# Vivado block design ps, Vivado 2016.2
# (continued, part 2 of 3)
current_bd_instance /RX

# ---- hierarchy /RX/rx_1 ----
current_bd_instance /RX/rx_1
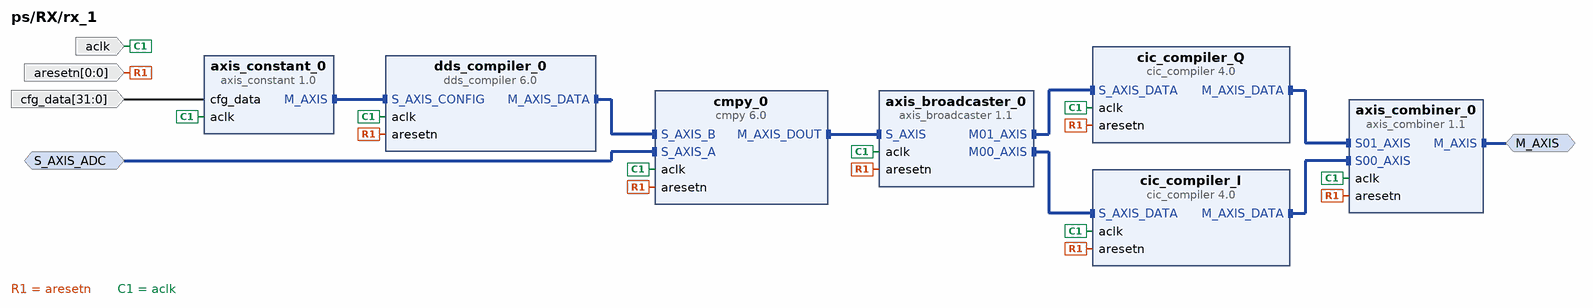
[diagram p5: block diagram inside /RX/rx_1]
create_bd_intf_pin -mode Slave -vlnv xilinx.com:interface:axis_rtl:1.0 S_AXIS_ADC
create_bd_intf_pin -mode Master -vlnv xilinx.com:interface:axis_rtl:1.0 M_AXIS
create_bd_pin -dir I aclk
create_bd_pin -dir I -from 0 -to 0 aresetn
create_bd_pin -dir I -from 31 -to 0 cfg_data

create_bd_cell -type ip -vlnv pavel-demin:user:axis_constant:1.0 axis_constant_0
create_bd_cell -type ip -vlnv xilinx.com:ip:axis_broadcaster:1.1 axis_broadcaster_0
set_property -dict [list \
  CONFIG.M_TDATA_NUM_BYTES 4 \
  CONFIG.S_TDATA_NUM_BYTES 8 \
  CONFIG.M00_TDATA_REMAP {tdata[31:0]} \
  CONFIG.M01_TDATA_REMAP {tdata[63:32]} \
] [get_bd_cells axis_broadcaster_0]
create_bd_cell -type ip -vlnv xilinx.com:ip:axis_combiner:1.1 axis_combiner_0
set_property -dict {CONFIG.TDATA_NUM_BYTES 4 CONFIG.HAS_TLAST 1} [get_bd_cells axis_combiner_0]
create_bd_cell -type ip -vlnv xilinx.com:ip:cic_compiler:4.0 cic_compiler_I
set_property -dict [list \
  CONFIG.Filter_Type Decimation \
  CONFIG.Number_Of_Stages 5 \
  CONFIG.Fixed_Or_Initial_Rate 32 \
  CONFIG.Minimum_Rate 32 \
  CONFIG.Maximum_Rate 32 \
  CONFIG.Input_Sample_Frequency 125 \
  CONFIG.Clock_Frequency 125 \
  CONFIG.SamplePeriod 1 \
  CONFIG.Input_Data_Width 32 \
  CONFIG.Quantization Truncation \
  CONFIG.Output_Data_Width 32 \
  CONFIG.Use_Xtreme_DSP_Slice false \
  CONFIG.HAS_ARESETN true \
  CONFIG.HAS_DOUT_TREADY true \
] [get_bd_cells cic_compiler_I]
create_bd_cell -type ip -vlnv xilinx.com:ip:cic_compiler:4.0 cic_compiler_Q
set_property -dict [list \
  CONFIG.Filter_Type Decimation \
  CONFIG.Number_Of_Stages 5 \
  CONFIG.Fixed_Or_Initial_Rate 32 \
  CONFIG.Minimum_Rate 32 \
  CONFIG.Maximum_Rate 32 \
  CONFIG.Input_Sample_Frequency 125 \
  CONFIG.Clock_Frequency 125 \
  CONFIG.SamplePeriod 1 \
  CONFIG.Input_Data_Width 32 \
  CONFIG.Quantization Truncation \
  CONFIG.Output_Data_Width 32 \
  CONFIG.Use_Xtreme_DSP_Slice false \
  CONFIG.HAS_ARESETN true \
  CONFIG.HAS_DOUT_TREADY true \
] [get_bd_cells cic_compiler_Q]
create_bd_cell -type ip -vlnv xilinx.com:ip:cmpy:6.0 cmpy_0
set_property -dict [list \
  CONFIG.APortWidth 16 \
  CONFIG.BPortWidth 24 \
  CONFIG.FlowControl Blocking \
  CONFIG.RoundMode Truncate \
  CONFIG.OutputWidth 32 \
  CONFIG.MinimumLatency 9 \
  CONFIG.ARESETN true \
] [get_bd_cells cmpy_0]
create_bd_cell -type ip -vlnv xilinx.com:ip:dds_compiler:6.0 dds_compiler_0
set_property -dict [list \
  CONFIG.PartsPresent Phase_Generator_and_SIN_COS_LUT \
  CONFIG.DDS_Clock_Rate 125 \
  CONFIG.Parameter_Entry System_Parameters \
  CONFIG.Spurious_Free_Dynamic_Range 138 \
  CONFIG.Frequency_Resolution 0.2 \
  CONFIG.Noise_Shaping Auto \
  CONFIG.Phase_Width 30 \
  CONFIG.Output_Width 24 \
  CONFIG.Phase_Increment Programmable \
  CONFIG.Negative_Sine true \
  CONFIG.Optimization_Goal Auto \
  CONFIG.DSP48_Use Minimal \
  CONFIG.Has_Phase_Out false \
  CONFIG.DATA_Has_TLAST Not_Required \
  CONFIG.Has_TREADY true \
  CONFIG.S_PHASE_Has_TUSER Not_Required \
  CONFIG.M_DATA_Has_TUSER Not_Required \
  CONFIG.Latency 16 \
  CONFIG.Has_ARESETn true \
  CONFIG.Output_Frequency1 0 \
  CONFIG.PINC1 0 \
] [get_bd_cells dds_compiler_0]

# ---- hierarchy /RX/RX_Connect ----
current_bd_instance /RX/RX_Connect
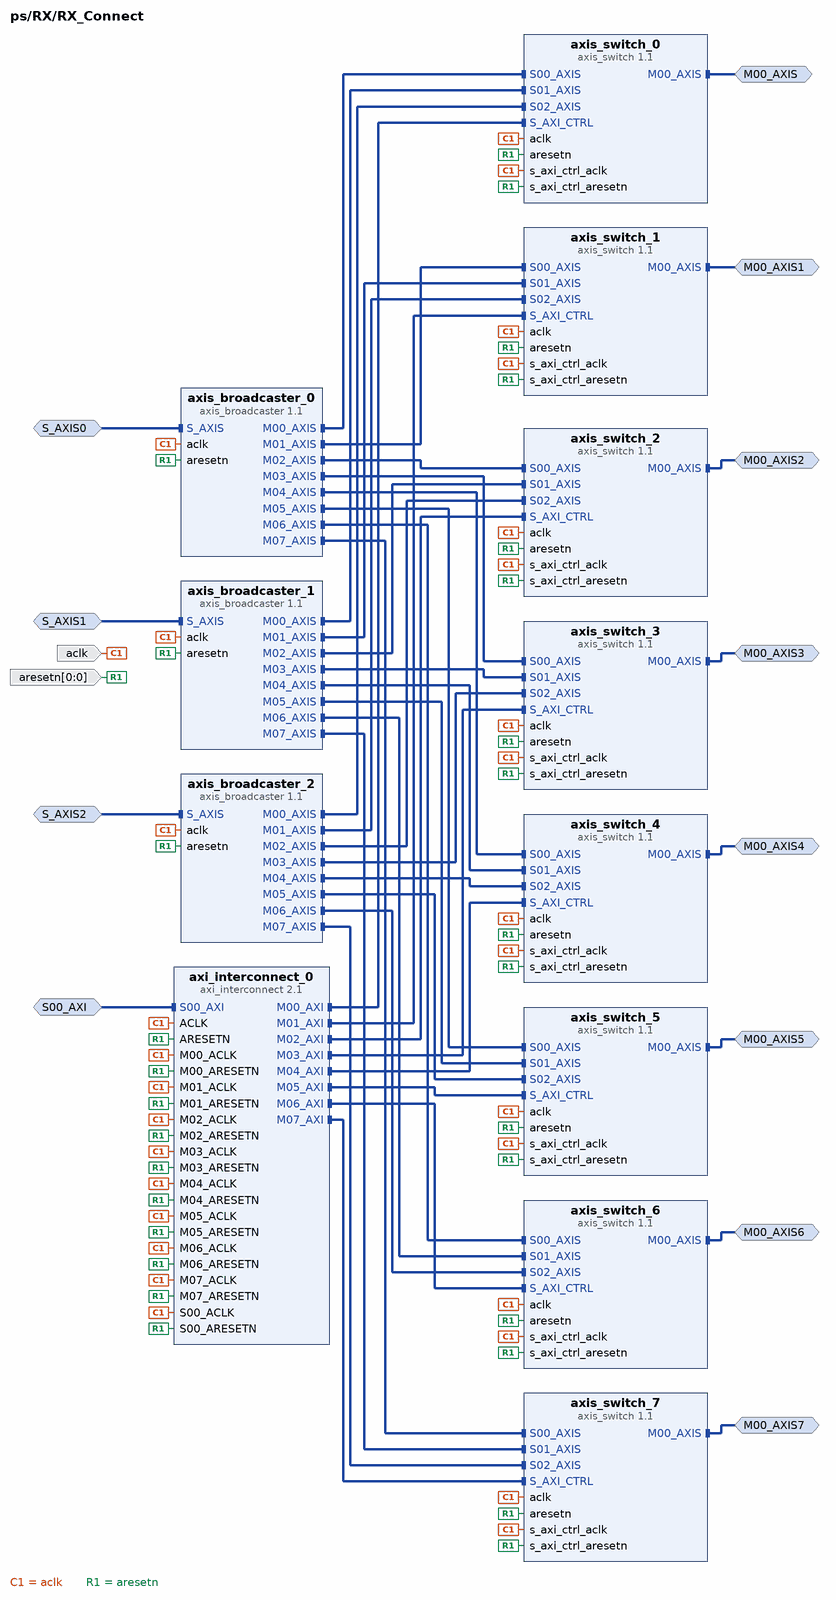
[diagram p6: block diagram inside /RX/RX_Connect]
create_bd_intf_pin -mode Master -vlnv xilinx.com:interface:axis_rtl:1.0 M00_AXIS
create_bd_intf_pin -mode Master -vlnv xilinx.com:interface:axis_rtl:1.0 M00_AXIS1
create_bd_intf_pin -mode Master -vlnv xilinx.com:interface:axis_rtl:1.0 M00_AXIS2
create_bd_intf_pin -mode Slave -vlnv xilinx.com:interface:axis_rtl:1.0 S_AXIS2
create_bd_intf_pin -mode Master -vlnv xilinx.com:interface:axis_rtl:1.0 M00_AXIS3
create_bd_intf_pin -mode Slave -vlnv xilinx.com:interface:axis_rtl:1.0 S_AXIS1
create_bd_intf_pin -mode Slave -vlnv xilinx.com:interface:axis_rtl:1.0 S_AXIS0
create_bd_intf_pin -mode Slave -vlnv xilinx.com:interface:aximm_rtl:1.0 S00_AXI
create_bd_intf_pin -mode Master -vlnv xilinx.com:interface:axis_rtl:1.0 M00_AXIS4
create_bd_intf_pin -mode Master -vlnv xilinx.com:interface:axis_rtl:1.0 M00_AXIS5
create_bd_intf_pin -mode Master -vlnv xilinx.com:interface:axis_rtl:1.0 M00_AXIS6
create_bd_intf_pin -mode Master -vlnv xilinx.com:interface:axis_rtl:1.0 M00_AXIS7
create_bd_pin -dir I -type clk aclk
create_bd_pin -dir I -from 0 -to 0 -type rst aresetn

create_bd_cell -type ip -vlnv xilinx.com:ip:axi_interconnect:2.1 axi_interconnect_0
set_property -dict [list \
  CONFIG.NUM_MI 8 \
  CONFIG.STRATEGY 1 \
  CONFIG.ENABLE_ADVANCED_OPTIONS 0 \
  CONFIG.M00_HAS_REGSLICE 0 \
] [get_bd_cells axi_interconnect_0]
create_bd_cell -type ip -vlnv xilinx.com:ip:axis_broadcaster:1.1 axis_broadcaster_0
set_property -dict [list \
  CONFIG.NUM_MI 8 \
  CONFIG.M_TDATA_NUM_BYTES 4 \
  CONFIG.S_TDATA_NUM_BYTES 4 \
  CONFIG.HAS_TREADY 0 \
  CONFIG.M02_TDATA_REMAP {tdata[31:0]} \
  CONFIG.M03_TDATA_REMAP {tdata[31:0]} \
  CONFIG.M04_TDATA_REMAP {tdata[31:0]} \
  CONFIG.M05_TDATA_REMAP {tdata[31:0]} \
  CONFIG.M06_TDATA_REMAP {tdata[31:0]} \
  CONFIG.M07_TDATA_REMAP {tdata[31:0]} \
  CONFIG.M08_TDATA_REMAP {tdata[31:0]} \
  CONFIG.M09_TDATA_REMAP {tdata[31:0]} \
  CONFIG.M10_TDATA_REMAP {tdata[31:0]} \
  CONFIG.M11_TDATA_REMAP {tdata[31:0]} \
  CONFIG.M12_TDATA_REMAP {tdata[31:0]} \
  CONFIG.M13_TDATA_REMAP {tdata[31:0]} \
  CONFIG.M14_TDATA_REMAP {tdata[31:0]} \
  CONFIG.M15_TDATA_REMAP {tdata[31:0]} \
] [get_bd_cells axis_broadcaster_0]
create_bd_cell -type ip -vlnv xilinx.com:ip:axis_broadcaster:1.1 axis_broadcaster_2
set_property -dict [list \
  CONFIG.NUM_MI 8 \
  CONFIG.M_TDATA_NUM_BYTES 4 \
  CONFIG.S_TDATA_NUM_BYTES 4 \
  CONFIG.HAS_TREADY 0 \
  CONFIG.M02_TDATA_REMAP {tdata[31:0]} \
  CONFIG.M03_TDATA_REMAP {tdata[31:0]} \
  CONFIG.M04_TDATA_REMAP {tdata[31:0]} \
  CONFIG.M05_TDATA_REMAP {tdata[31:0]} \
  CONFIG.M06_TDATA_REMAP {tdata[31:0]} \
  CONFIG.M07_TDATA_REMAP {tdata[31:0]} \
  CONFIG.M08_TDATA_REMAP {tdata[31:0]} \
  CONFIG.M09_TDATA_REMAP {tdata[31:0]} \
  CONFIG.M10_TDATA_REMAP {tdata[31:0]} \
  CONFIG.M11_TDATA_REMAP {tdata[31:0]} \
  CONFIG.M12_TDATA_REMAP {tdata[31:0]} \
  CONFIG.M13_TDATA_REMAP {tdata[31:0]} \
  CONFIG.M14_TDATA_REMAP {tdata[31:0]} \
  CONFIG.M15_TDATA_REMAP {tdata[31:0]} \
] [get_bd_cells axis_broadcaster_2]
create_bd_cell -type ip -vlnv xilinx.com:ip:axis_broadcaster:1.1 axis_broadcaster_1
set_property -dict [list \
  CONFIG.NUM_MI 8 \
  CONFIG.M_TDATA_NUM_BYTES 4 \
  CONFIG.S_TDATA_NUM_BYTES 4 \
  CONFIG.HAS_TREADY 0 \
  CONFIG.M02_TDATA_REMAP {tdata[31:0]} \
  CONFIG.M03_TDATA_REMAP {tdata[31:0]} \
  CONFIG.M04_TDATA_REMAP {tdata[31:0]} \
  CONFIG.M05_TDATA_REMAP {tdata[31:0]} \
  CONFIG.M06_TDATA_REMAP {tdata[31:0]} \
  CONFIG.M07_TDATA_REMAP {tdata[31:0]} \
  CONFIG.M08_TDATA_REMAP {tdata[31:0]} \
  CONFIG.M09_TDATA_REMAP {tdata[31:0]} \
  CONFIG.M10_TDATA_REMAP {tdata[31:0]} \
  CONFIG.M11_TDATA_REMAP {tdata[31:0]} \
  CONFIG.M12_TDATA_REMAP {tdata[31:0]} \
  CONFIG.M13_TDATA_REMAP {tdata[31:0]} \
  CONFIG.M14_TDATA_REMAP {tdata[31:0]} \
  CONFIG.M15_TDATA_REMAP {tdata[31:0]} \
] [get_bd_cells axis_broadcaster_1]
create_bd_cell -type ip -vlnv xilinx.com:ip:axis_switch:1.1 axis_switch_0
set_property -dict [list \
  CONFIG.NUM_SI 3 \
  CONFIG.ROUTING_MODE 1 \
  CONFIG.HAS_TREADY 0 \
  CONFIG.TDATA_NUM_BYTES 4 \
] [get_bd_cells axis_switch_0]
create_bd_cell -type ip -vlnv xilinx.com:ip:axis_switch:1.1 axis_switch_1
set_property -dict [list \
  CONFIG.NUM_SI 3 \
  CONFIG.ROUTING_MODE 1 \
  CONFIG.HAS_TREADY 0 \
  CONFIG.TDATA_NUM_BYTES 4 \
] [get_bd_cells axis_switch_1]
create_bd_cell -type ip -vlnv xilinx.com:ip:axis_switch:1.1 axis_switch_2
set_property -dict [list \
  CONFIG.NUM_SI 3 \
  CONFIG.ROUTING_MODE 1 \
  CONFIG.HAS_TREADY 0 \
  CONFIG.TDATA_NUM_BYTES 4 \
] [get_bd_cells axis_switch_2]
create_bd_cell -type ip -vlnv xilinx.com:ip:axis_switch:1.1 axis_switch_3
set_property -dict [list \
  CONFIG.NUM_SI 3 \
  CONFIG.ROUTING_MODE 1 \
  CONFIG.HAS_TREADY 0 \
  CONFIG.TDATA_NUM_BYTES 4 \
] [get_bd_cells axis_switch_3]
create_bd_cell -type ip -vlnv xilinx.com:ip:axis_switch:1.1 axis_switch_4
set_property -dict [list \
  CONFIG.NUM_SI 3 \
  CONFIG.ROUTING_MODE 1 \
  CONFIG.HAS_TREADY 0 \
  CONFIG.TDATA_NUM_BYTES 4 \
] [get_bd_cells axis_switch_4]
create_bd_cell -type ip -vlnv xilinx.com:ip:axis_switch:1.1 axis_switch_5
set_property -dict [list \
  CONFIG.NUM_SI 3 \
  CONFIG.ROUTING_MODE 1 \
  CONFIG.HAS_TREADY 0 \
  CONFIG.TDATA_NUM_BYTES 4 \
] [get_bd_cells axis_switch_5]
create_bd_cell -type ip -vlnv xilinx.com:ip:axis_switch:1.1 axis_switch_6
set_property -dict [list \
  CONFIG.NUM_SI 3 \
  CONFIG.ROUTING_MODE 1 \
  CONFIG.HAS_TREADY 0 \
  CONFIG.TDATA_NUM_BYTES 4 \
] [get_bd_cells axis_switch_6]
create_bd_cell -type ip -vlnv xilinx.com:ip:axis_switch:1.1 axis_switch_7
set_property -dict [list \
  CONFIG.NUM_SI 3 \
  CONFIG.ROUTING_MODE 1 \
  CONFIG.HAS_TREADY 0 \
  CONFIG.TDATA_NUM_BYTES 4 \
] [get_bd_cells axis_switch_7]

# ---- hierarchy /RX/rx_2 ----
current_bd_instance /RX/rx_2
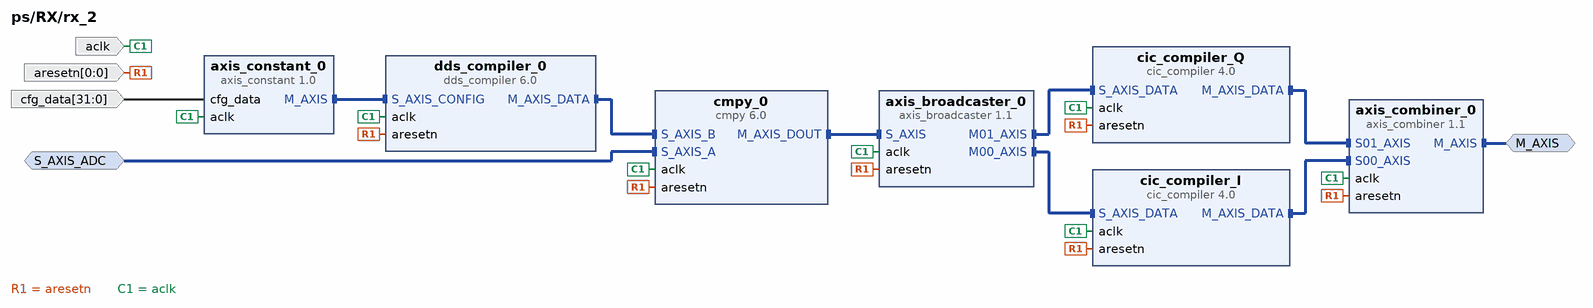
[diagram p7: block diagram inside /RX/rx_2]
create_bd_intf_pin -mode Slave -vlnv xilinx.com:interface:axis_rtl:1.0 S_AXIS_ADC
create_bd_intf_pin -mode Master -vlnv xilinx.com:interface:axis_rtl:1.0 M_AXIS
create_bd_pin -dir I aclk
create_bd_pin -dir I -from 0 -to 0 aresetn
create_bd_pin -dir I -from 31 -to 0 cfg_data

create_bd_cell -type ip -vlnv pavel-demin:user:axis_constant:1.0 axis_constant_0
create_bd_cell -type ip -vlnv xilinx.com:ip:axis_broadcaster:1.1 axis_broadcaster_0
set_property -dict [list \
  CONFIG.M_TDATA_NUM_BYTES 4 \
  CONFIG.S_TDATA_NUM_BYTES 8 \
  CONFIG.M00_TDATA_REMAP {tdata[31:0]} \
  CONFIG.M01_TDATA_REMAP {tdata[63:32]} \
] [get_bd_cells axis_broadcaster_0]
create_bd_cell -type ip -vlnv xilinx.com:ip:axis_combiner:1.1 axis_combiner_0
set_property -dict {CONFIG.TDATA_NUM_BYTES 4 CONFIG.HAS_TLAST 1} [get_bd_cells axis_combiner_0]
create_bd_cell -type ip -vlnv xilinx.com:ip:cic_compiler:4.0 cic_compiler_I
set_property -dict [list \
  CONFIG.Filter_Type Decimation \
  CONFIG.Number_Of_Stages 5 \
  CONFIG.Fixed_Or_Initial_Rate 32 \
  CONFIG.Minimum_Rate 32 \
  CONFIG.Maximum_Rate 32 \
  CONFIG.Input_Sample_Frequency 125 \
  CONFIG.Clock_Frequency 125 \
  CONFIG.SamplePeriod 1 \
  CONFIG.Input_Data_Width 32 \
  CONFIG.Quantization Truncation \
  CONFIG.Output_Data_Width 32 \
  CONFIG.Use_Xtreme_DSP_Slice false \
  CONFIG.HAS_ARESETN true \
  CONFIG.HAS_DOUT_TREADY true \
] [get_bd_cells cic_compiler_I]
create_bd_cell -type ip -vlnv xilinx.com:ip:cic_compiler:4.0 cic_compiler_Q
set_property -dict [list \
  CONFIG.Filter_Type Decimation \
  CONFIG.Number_Of_Stages 5 \
  CONFIG.Fixed_Or_Initial_Rate 32 \
  CONFIG.Minimum_Rate 32 \
  CONFIG.Maximum_Rate 32 \
  CONFIG.Input_Sample_Frequency 125 \
  CONFIG.Clock_Frequency 125 \
  CONFIG.SamplePeriod 1 \
  CONFIG.Input_Data_Width 32 \
  CONFIG.Quantization Truncation \
  CONFIG.Output_Data_Width 32 \
  CONFIG.Use_Xtreme_DSP_Slice false \
  CONFIG.HAS_ARESETN true \
  CONFIG.HAS_DOUT_TREADY true \
] [get_bd_cells cic_compiler_Q]
create_bd_cell -type ip -vlnv xilinx.com:ip:cmpy:6.0 cmpy_0
set_property -dict [list \
  CONFIG.APortWidth 16 \
  CONFIG.BPortWidth 24 \
  CONFIG.FlowControl Blocking \
  CONFIG.RoundMode Truncate \
  CONFIG.OutputWidth 32 \
  CONFIG.MinimumLatency 9 \
  CONFIG.ARESETN true \
] [get_bd_cells cmpy_0]
create_bd_cell -type ip -vlnv xilinx.com:ip:dds_compiler:6.0 dds_compiler_0
set_property -dict [list \
  CONFIG.PartsPresent Phase_Generator_and_SIN_COS_LUT \
  CONFIG.DDS_Clock_Rate 125 \
  CONFIG.Parameter_Entry System_Parameters \
  CONFIG.Spurious_Free_Dynamic_Range 138 \
  CONFIG.Frequency_Resolution 0.2 \
  CONFIG.Noise_Shaping Auto \
  CONFIG.Phase_Width 30 \
  CONFIG.Output_Width 24 \
  CONFIG.Phase_Increment Programmable \
  CONFIG.Negative_Sine true \
  CONFIG.Optimization_Goal Auto \
  CONFIG.DSP48_Use Minimal \
  CONFIG.Has_Phase_Out false \
  CONFIG.DATA_Has_TLAST Not_Required \
  CONFIG.Has_TREADY true \
  CONFIG.S_PHASE_Has_TUSER Not_Required \
  CONFIG.M_DATA_Has_TUSER Not_Required \
  CONFIG.Latency 16 \
  CONFIG.Has_ARESETn true \
  CONFIG.Output_Frequency1 0 \
  CONFIG.PINC1 0 \
] [get_bd_cells dds_compiler_0]

# ---- hierarchy /RX/rx_3 ----
current_bd_instance /RX/rx_3
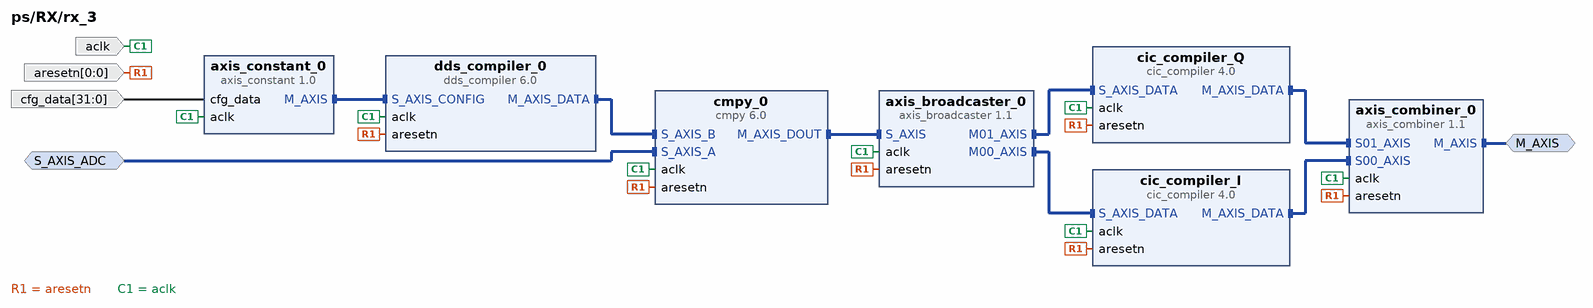
[diagram p8: block diagram inside /RX/rx_3]
create_bd_intf_pin -mode Slave -vlnv xilinx.com:interface:axis_rtl:1.0 S_AXIS_ADC
create_bd_intf_pin -mode Master -vlnv xilinx.com:interface:axis_rtl:1.0 M_AXIS
create_bd_pin -dir I aclk
create_bd_pin -dir I -from 0 -to 0 aresetn
create_bd_pin -dir I -from 31 -to 0 cfg_data

create_bd_cell -type ip -vlnv pavel-demin:user:axis_constant:1.0 axis_constant_0
create_bd_cell -type ip -vlnv xilinx.com:ip:axis_broadcaster:1.1 axis_broadcaster_0
set_property -dict [list \
  CONFIG.M_TDATA_NUM_BYTES 4 \
  CONFIG.S_TDATA_NUM_BYTES 8 \
  CONFIG.M00_TDATA_REMAP {tdata[31:0]} \
  CONFIG.M01_TDATA_REMAP {tdata[63:32]} \
] [get_bd_cells axis_broadcaster_0]
create_bd_cell -type ip -vlnv xilinx.com:ip:axis_combiner:1.1 axis_combiner_0
set_property -dict {CONFIG.TDATA_NUM_BYTES 4 CONFIG.HAS_TLAST 1} [get_bd_cells axis_combiner_0]
create_bd_cell -type ip -vlnv xilinx.com:ip:cic_compiler:4.0 cic_compiler_I
set_property -dict [list \
  CONFIG.Filter_Type Decimation \
  CONFIG.Number_Of_Stages 5 \
  CONFIG.Fixed_Or_Initial_Rate 32 \
  CONFIG.Minimum_Rate 32 \
  CONFIG.Maximum_Rate 32 \
  CONFIG.Input_Sample_Frequency 125 \
  CONFIG.Clock_Frequency 125 \
  CONFIG.SamplePeriod 1 \
  CONFIG.Input_Data_Width 32 \
  CONFIG.Quantization Truncation \
  CONFIG.Output_Data_Width 32 \
  CONFIG.Use_Xtreme_DSP_Slice false \
  CONFIG.HAS_ARESETN true \
  CONFIG.HAS_DOUT_TREADY true \
] [get_bd_cells cic_compiler_I]
create_bd_cell -type ip -vlnv xilinx.com:ip:cic_compiler:4.0 cic_compiler_Q
set_property -dict [list \
  CONFIG.Filter_Type Decimation \
  CONFIG.Number_Of_Stages 5 \
  CONFIG.Fixed_Or_Initial_Rate 32 \
  CONFIG.Minimum_Rate 32 \
  CONFIG.Maximum_Rate 32 \
  CONFIG.Input_Sample_Frequency 125 \
  CONFIG.Clock_Frequency 125 \
  CONFIG.SamplePeriod 1 \
  CONFIG.Input_Data_Width 32 \
  CONFIG.Quantization Truncation \
  CONFIG.Output_Data_Width 32 \
  CONFIG.Use_Xtreme_DSP_Slice false \
  CONFIG.HAS_ARESETN true \
  CONFIG.HAS_DOUT_TREADY true \
] [get_bd_cells cic_compiler_Q]
create_bd_cell -type ip -vlnv xilinx.com:ip:cmpy:6.0 cmpy_0
set_property -dict [list \
  CONFIG.APortWidth 16 \
  CONFIG.BPortWidth 24 \
  CONFIG.FlowControl Blocking \
  CONFIG.RoundMode Truncate \
  CONFIG.OutputWidth 32 \
  CONFIG.MinimumLatency 9 \
  CONFIG.ARESETN true \
] [get_bd_cells cmpy_0]
create_bd_cell -type ip -vlnv xilinx.com:ip:dds_compiler:6.0 dds_compiler_0
set_property -dict [list \
  CONFIG.PartsPresent Phase_Generator_and_SIN_COS_LUT \
  CONFIG.DDS_Clock_Rate 125 \
  CONFIG.Parameter_Entry System_Parameters \
  CONFIG.Spurious_Free_Dynamic_Range 138 \
  CONFIG.Frequency_Resolution 0.2 \
  CONFIG.Noise_Shaping Auto \
  CONFIG.Phase_Width 30 \
  CONFIG.Output_Width 24 \
  CONFIG.Phase_Increment Programmable \
  CONFIG.Negative_Sine true \
  CONFIG.Optimization_Goal Auto \
  CONFIG.DSP48_Use Minimal \
  CONFIG.Has_Phase_Out false \
  CONFIG.DATA_Has_TLAST Not_Required \
  CONFIG.Has_TREADY true \
  CONFIG.S_PHASE_Has_TUSER Not_Required \
  CONFIG.M_DATA_Has_TUSER Not_Required \
  CONFIG.Latency 16 \
  CONFIG.Has_ARESETn true \
  CONFIG.Output_Frequency1 0 \
  CONFIG.PINC1 0 \
] [get_bd_cells dds_compiler_0]

# ---- hierarchy /RX/rx_0 ----
current_bd_instance /RX/rx_0
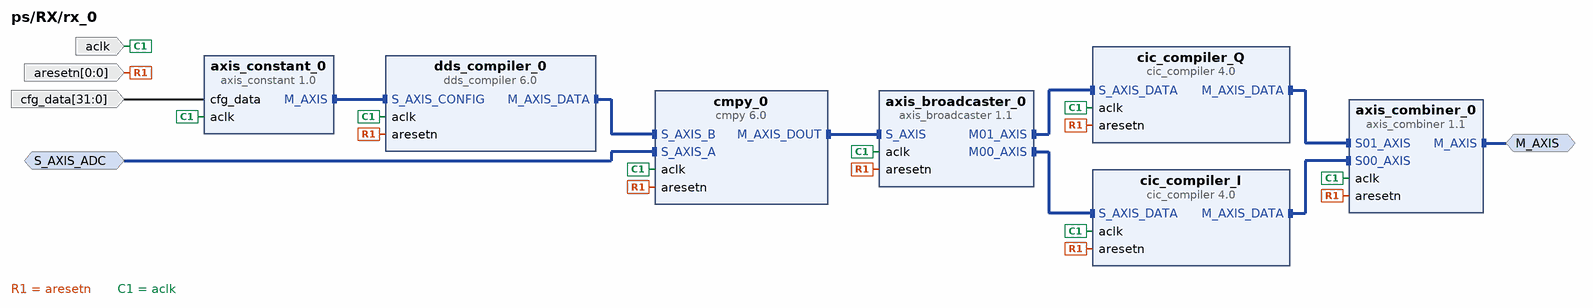
[diagram p9: block diagram inside /RX/rx_0]
create_bd_intf_pin -mode Slave -vlnv xilinx.com:interface:axis_rtl:1.0 S_AXIS_ADC
create_bd_intf_pin -mode Master -vlnv xilinx.com:interface:axis_rtl:1.0 M_AXIS
create_bd_pin -dir I aclk
create_bd_pin -dir I -from 0 -to 0 aresetn
create_bd_pin -dir I -from 31 -to 0 cfg_data

create_bd_cell -type ip -vlnv pavel-demin:user:axis_constant:1.0 axis_constant_0
create_bd_cell -type ip -vlnv xilinx.com:ip:axis_broadcaster:1.1 axis_broadcaster_0
set_property -dict [list \
  CONFIG.M_TDATA_NUM_BYTES 4 \
  CONFIG.S_TDATA_NUM_BYTES 8 \
  CONFIG.M00_TDATA_REMAP {tdata[31:0]} \
  CONFIG.M01_TDATA_REMAP {tdata[63:32]} \
] [get_bd_cells axis_broadcaster_0]
create_bd_cell -type ip -vlnv xilinx.com:ip:axis_combiner:1.1 axis_combiner_0
set_property -dict {CONFIG.TDATA_NUM_BYTES 4 CONFIG.HAS_TLAST 1} [get_bd_cells axis_combiner_0]
create_bd_cell -type ip -vlnv xilinx.com:ip:cic_compiler:4.0 cic_compiler_I
set_property -dict [list \
  CONFIG.Filter_Type Decimation \
  CONFIG.Number_Of_Stages 5 \
  CONFIG.Fixed_Or_Initial_Rate 32 \
  CONFIG.Minimum_Rate 32 \
  CONFIG.Maximum_Rate 32 \
  CONFIG.Input_Sample_Frequency 125 \
  CONFIG.Clock_Frequency 125 \
  CONFIG.SamplePeriod 1 \
  CONFIG.Input_Data_Width 32 \
  CONFIG.Quantization Truncation \
  CONFIG.Output_Data_Width 32 \
  CONFIG.Use_Xtreme_DSP_Slice false \
  CONFIG.HAS_ARESETN true \
  CONFIG.HAS_DOUT_TREADY true \
] [get_bd_cells cic_compiler_I]
create_bd_cell -type ip -vlnv xilinx.com:ip:cic_compiler:4.0 cic_compiler_Q
set_property -dict [list \
  CONFIG.Filter_Type Decimation \
  CONFIG.Number_Of_Stages 5 \
  CONFIG.Fixed_Or_Initial_Rate 32 \
  CONFIG.Minimum_Rate 32 \
  CONFIG.Maximum_Rate 32 \
  CONFIG.Input_Sample_Frequency 125 \
  CONFIG.Clock_Frequency 125 \
  CONFIG.SamplePeriod 1 \
  CONFIG.Input_Data_Width 32 \
  CONFIG.Quantization Truncation \
  CONFIG.Output_Data_Width 32 \
  CONFIG.Use_Xtreme_DSP_Slice false \
  CONFIG.HAS_ARESETN true \
  CONFIG.HAS_DOUT_TREADY true \
] [get_bd_cells cic_compiler_Q]
create_bd_cell -type ip -vlnv xilinx.com:ip:cmpy:6.0 cmpy_0
set_property -dict [list \
  CONFIG.APortWidth 16 \
  CONFIG.BPortWidth 24 \
  CONFIG.FlowControl Blocking \
  CONFIG.RoundMode Truncate \
  CONFIG.OutputWidth 32 \
  CONFIG.MinimumLatency 9 \
  CONFIG.ARESETN true \
] [get_bd_cells cmpy_0]
create_bd_cell -type ip -vlnv xilinx.com:ip:dds_compiler:6.0 dds_compiler_0
set_property -dict [list \
  CONFIG.PartsPresent Phase_Generator_and_SIN_COS_LUT \
  CONFIG.DDS_Clock_Rate 125 \
  CONFIG.Parameter_Entry System_Parameters \
  CONFIG.Spurious_Free_Dynamic_Range 138 \
  CONFIG.Frequency_Resolution 0.2 \
  CONFIG.Noise_Shaping Auto \
  CONFIG.Phase_Width 30 \
  CONFIG.Output_Width 24 \
  CONFIG.Phase_Increment Programmable \
  CONFIG.Negative_Sine true \
  CONFIG.Optimization_Goal Auto \
  CONFIG.DSP48_Use Minimal \
  CONFIG.Has_Phase_Out false \
  CONFIG.DATA_Has_TLAST Not_Required \
  CONFIG.Has_TREADY true \
  CONFIG.S_PHASE_Has_TUSER Not_Required \
  CONFIG.M_DATA_Has_TUSER Not_Required \
  CONFIG.Latency 16 \
  CONFIG.Has_ARESETn true \
  CONFIG.Output_Frequency1 0 \
  CONFIG.PINC1 0 \
] [get_bd_cells dds_compiler_0]

# ---- hierarchy /RX/rx_4 ----
current_bd_instance /RX/rx_4
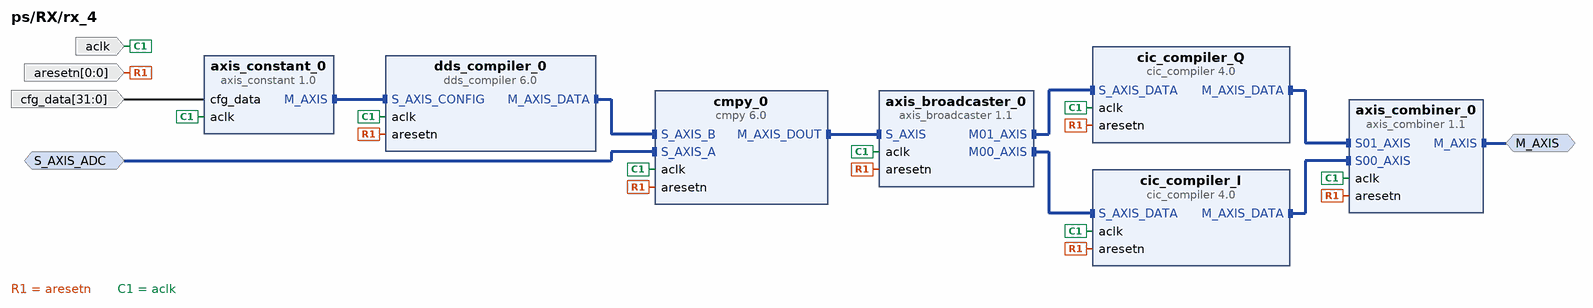
[diagram p10: block diagram inside /RX/rx_4]
create_bd_intf_pin -mode Slave -vlnv xilinx.com:interface:axis_rtl:1.0 S_AXIS_ADC
create_bd_intf_pin -mode Master -vlnv xilinx.com:interface:axis_rtl:1.0 M_AXIS
create_bd_pin -dir I aclk
create_bd_pin -dir I -from 0 -to 0 aresetn
create_bd_pin -dir I -from 31 -to 0 cfg_data

create_bd_cell -type ip -vlnv pavel-demin:user:axis_constant:1.0 axis_constant_0
create_bd_cell -type ip -vlnv xilinx.com:ip:axis_broadcaster:1.1 axis_broadcaster_0
set_property -dict [list \
  CONFIG.M_TDATA_NUM_BYTES 4 \
  CONFIG.S_TDATA_NUM_BYTES 8 \
  CONFIG.M00_TDATA_REMAP {tdata[31:0]} \
  CONFIG.M01_TDATA_REMAP {tdata[63:32]} \
] [get_bd_cells axis_broadcaster_0]
create_bd_cell -type ip -vlnv xilinx.com:ip:axis_combiner:1.1 axis_combiner_0
set_property -dict {CONFIG.TDATA_NUM_BYTES 4 CONFIG.HAS_TLAST 1} [get_bd_cells axis_combiner_0]
create_bd_cell -type ip -vlnv xilinx.com:ip:cic_compiler:4.0 cic_compiler_I
set_property -dict [list \
  CONFIG.Filter_Type Decimation \
  CONFIG.Number_Of_Stages 5 \
  CONFIG.Fixed_Or_Initial_Rate 32 \
  CONFIG.Minimum_Rate 32 \
  CONFIG.Maximum_Rate 32 \
  CONFIG.Input_Sample_Frequency 125 \
  CONFIG.Clock_Frequency 125 \
  CONFIG.SamplePeriod 1 \
  CONFIG.Input_Data_Width 32 \
  CONFIG.Quantization Truncation \
  CONFIG.Output_Data_Width 32 \
  CONFIG.Use_Xtreme_DSP_Slice false \
  CONFIG.HAS_ARESETN true \
  CONFIG.HAS_DOUT_TREADY true \
] [get_bd_cells cic_compiler_I]
create_bd_cell -type ip -vlnv xilinx.com:ip:cic_compiler:4.0 cic_compiler_Q
set_property -dict [list \
  CONFIG.Filter_Type Decimation \
  CONFIG.Number_Of_Stages 5 \
  CONFIG.Fixed_Or_Initial_Rate 32 \
  CONFIG.Minimum_Rate 32 \
  CONFIG.Maximum_Rate 32 \
  CONFIG.Input_Sample_Frequency 125 \
  CONFIG.Clock_Frequency 125 \
  CONFIG.SamplePeriod 1 \
  CONFIG.Input_Data_Width 32 \
  CONFIG.Quantization Truncation \
  CONFIG.Output_Data_Width 32 \
  CONFIG.Use_Xtreme_DSP_Slice false \
  CONFIG.HAS_ARESETN true \
  CONFIG.HAS_DOUT_TREADY true \
] [get_bd_cells cic_compiler_Q]
create_bd_cell -type ip -vlnv xilinx.com:ip:cmpy:6.0 cmpy_0
set_property -dict [list \
  CONFIG.APortWidth 16 \
  CONFIG.BPortWidth 24 \
  CONFIG.FlowControl Blocking \
  CONFIG.RoundMode Truncate \
  CONFIG.OutputWidth 32 \
  CONFIG.MinimumLatency 9 \
  CONFIG.ARESETN true \
] [get_bd_cells cmpy_0]
create_bd_cell -type ip -vlnv xilinx.com:ip:dds_compiler:6.0 dds_compiler_0
set_property -dict [list \
  CONFIG.PartsPresent Phase_Generator_and_SIN_COS_LUT \
  CONFIG.DDS_Clock_Rate 125 \
  CONFIG.Parameter_Entry System_Parameters \
  CONFIG.Spurious_Free_Dynamic_Range 138 \
  CONFIG.Frequency_Resolution 0.2 \
  CONFIG.Noise_Shaping Auto \
  CONFIG.Phase_Width 30 \
  CONFIG.Output_Width 24 \
  CONFIG.Phase_Increment Programmable \
  CONFIG.Negative_Sine true \
  CONFIG.Optimization_Goal Auto \
  CONFIG.DSP48_Use Minimal \
  CONFIG.Has_Phase_Out false \
  CONFIG.DATA_Has_TLAST Not_Required \
  CONFIG.Has_TREADY true \
  CONFIG.S_PHASE_Has_TUSER Not_Required \
  CONFIG.M_DATA_Has_TUSER Not_Required \
  CONFIG.Latency 16 \
  CONFIG.Has_ARESETn true \
  CONFIG.Output_Frequency1 0 \
  CONFIG.PINC1 0 \
] [get_bd_cells dds_compiler_0]

# ---- hierarchy /RX/rx_5 ----
current_bd_instance /RX/rx_5
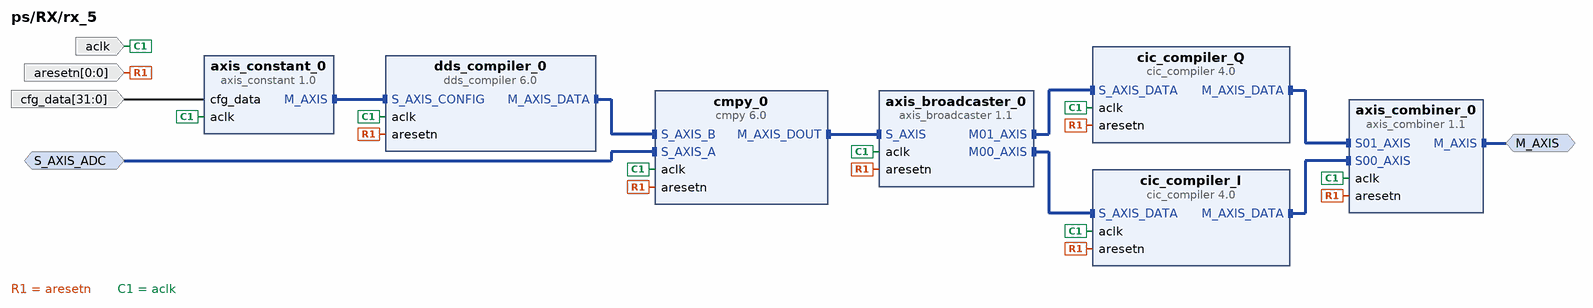
[diagram p11: block diagram inside /RX/rx_5]
create_bd_intf_pin -mode Slave -vlnv xilinx.com:interface:axis_rtl:1.0 S_AXIS_ADC
create_bd_intf_pin -mode Master -vlnv xilinx.com:interface:axis_rtl:1.0 M_AXIS
create_bd_pin -dir I aclk
create_bd_pin -dir I -from 0 -to 0 aresetn
create_bd_pin -dir I -from 31 -to 0 cfg_data

create_bd_cell -type ip -vlnv pavel-demin:user:axis_constant:1.0 axis_constant_0
create_bd_cell -type ip -vlnv xilinx.com:ip:axis_broadcaster:1.1 axis_broadcaster_0
set_property -dict [list \
  CONFIG.M_TDATA_NUM_BYTES 4 \
  CONFIG.S_TDATA_NUM_BYTES 8 \
  CONFIG.M00_TDATA_REMAP {tdata[31:0]} \
  CONFIG.M01_TDATA_REMAP {tdata[63:32]} \
] [get_bd_cells axis_broadcaster_0]
create_bd_cell -type ip -vlnv xilinx.com:ip:axis_combiner:1.1 axis_combiner_0
set_property -dict {CONFIG.TDATA_NUM_BYTES 4 CONFIG.HAS_TLAST 1} [get_bd_cells axis_combiner_0]
create_bd_cell -type ip -vlnv xilinx.com:ip:cic_compiler:4.0 cic_compiler_I
set_property -dict [list \
  CONFIG.Filter_Type Decimation \
  CONFIG.Number_Of_Stages 5 \
  CONFIG.Fixed_Or_Initial_Rate 32 \
  CONFIG.Minimum_Rate 32 \
  CONFIG.Maximum_Rate 32 \
  CONFIG.Input_Sample_Frequency 125 \
  CONFIG.Clock_Frequency 125 \
  CONFIG.SamplePeriod 1 \
  CONFIG.Input_Data_Width 32 \
  CONFIG.Quantization Truncation \
  CONFIG.Output_Data_Width 32 \
  CONFIG.Use_Xtreme_DSP_Slice false \
  CONFIG.HAS_ARESETN true \
  CONFIG.HAS_DOUT_TREADY true \
] [get_bd_cells cic_compiler_I]
create_bd_cell -type ip -vlnv xilinx.com:ip:cic_compiler:4.0 cic_compiler_Q
set_property -dict [list \
  CONFIG.Filter_Type Decimation \
  CONFIG.Number_Of_Stages 5 \
  CONFIG.Fixed_Or_Initial_Rate 32 \
  CONFIG.Minimum_Rate 32 \
  CONFIG.Maximum_Rate 32 \
  CONFIG.Input_Sample_Frequency 125 \
  CONFIG.Clock_Frequency 125 \
  CONFIG.SamplePeriod 1 \
  CONFIG.Input_Data_Width 32 \
  CONFIG.Quantization Truncation \
  CONFIG.Output_Data_Width 32 \
  CONFIG.Use_Xtreme_DSP_Slice false \
  CONFIG.HAS_ARESETN true \
  CONFIG.HAS_DOUT_TREADY true \
] [get_bd_cells cic_compiler_Q]
create_bd_cell -type ip -vlnv xilinx.com:ip:cmpy:6.0 cmpy_0
set_property -dict [list \
  CONFIG.APortWidth 16 \
  CONFIG.BPortWidth 24 \
  CONFIG.FlowControl Blocking \
  CONFIG.RoundMode Truncate \
  CONFIG.OutputWidth 32 \
  CONFIG.MinimumLatency 9 \
  CONFIG.ARESETN true \
] [get_bd_cells cmpy_0]
create_bd_cell -type ip -vlnv xilinx.com:ip:dds_compiler:6.0 dds_compiler_0
set_property -dict [list \
  CONFIG.PartsPresent Phase_Generator_and_SIN_COS_LUT \
  CONFIG.DDS_Clock_Rate 125 \
  CONFIG.Parameter_Entry System_Parameters \
  CONFIG.Spurious_Free_Dynamic_Range 138 \
  CONFIG.Frequency_Resolution 0.2 \
  CONFIG.Noise_Shaping Auto \
  CONFIG.Phase_Width 30 \
  CONFIG.Output_Width 24 \
  CONFIG.Phase_Increment Programmable \
  CONFIG.Negative_Sine true \
  CONFIG.Optimization_Goal Auto \
  CONFIG.DSP48_Use Minimal \
  CONFIG.Has_Phase_Out false \
  CONFIG.DATA_Has_TLAST Not_Required \
  CONFIG.Has_TREADY true \
  CONFIG.S_PHASE_Has_TUSER Not_Required \
  CONFIG.M_DATA_Has_TUSER Not_Required \
  CONFIG.Latency 16 \
  CONFIG.Has_ARESETn true \
  CONFIG.Output_Frequency1 0 \
  CONFIG.PINC1 0 \
] [get_bd_cells dds_compiler_0]

# ---- hierarchy /RX/rx_6 ----
current_bd_instance /RX/rx_6
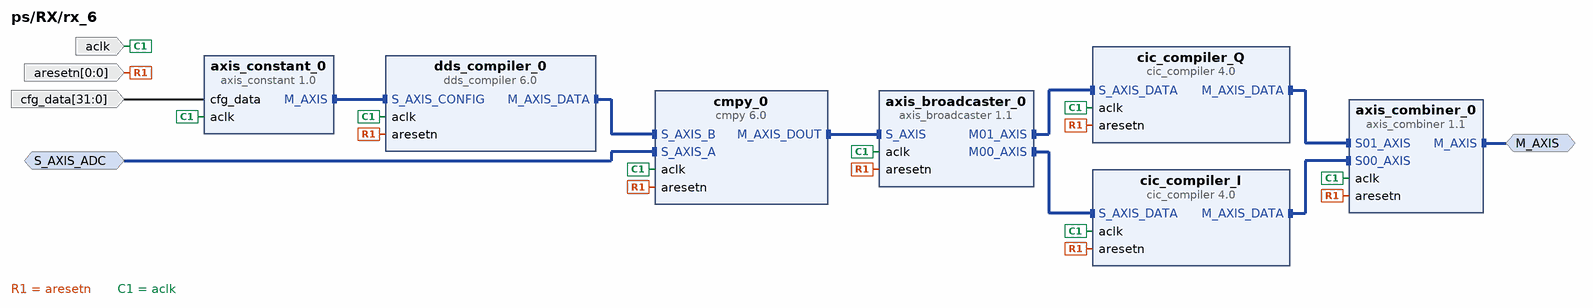
[diagram p12: block diagram inside /RX/rx_6]
create_bd_intf_pin -mode Slave -vlnv xilinx.com:interface:axis_rtl:1.0 S_AXIS_ADC
create_bd_intf_pin -mode Master -vlnv xilinx.com:interface:axis_rtl:1.0 M_AXIS
create_bd_pin -dir I aclk
create_bd_pin -dir I -from 0 -to 0 aresetn
create_bd_pin -dir I -from 31 -to 0 cfg_data

create_bd_cell -type ip -vlnv pavel-demin:user:axis_constant:1.0 axis_constant_0
create_bd_cell -type ip -vlnv xilinx.com:ip:axis_broadcaster:1.1 axis_broadcaster_0
set_property -dict [list \
  CONFIG.M_TDATA_NUM_BYTES 4 \
  CONFIG.S_TDATA_NUM_BYTES 8 \
  CONFIG.M00_TDATA_REMAP {tdata[31:0]} \
  CONFIG.M01_TDATA_REMAP {tdata[63:32]} \
] [get_bd_cells axis_broadcaster_0]
create_bd_cell -type ip -vlnv xilinx.com:ip:axis_combiner:1.1 axis_combiner_0
set_property -dict {CONFIG.TDATA_NUM_BYTES 4 CONFIG.HAS_TLAST 1} [get_bd_cells axis_combiner_0]
create_bd_cell -type ip -vlnv xilinx.com:ip:cic_compiler:4.0 cic_compiler_I
set_property -dict [list \
  CONFIG.Filter_Type Decimation \
  CONFIG.Number_Of_Stages 5 \
  CONFIG.Fixed_Or_Initial_Rate 32 \
  CONFIG.Minimum_Rate 32 \
  CONFIG.Maximum_Rate 32 \
  CONFIG.Input_Sample_Frequency 125 \
  CONFIG.Clock_Frequency 125 \
  CONFIG.SamplePeriod 1 \
  CONFIG.Input_Data_Width 32 \
  CONFIG.Quantization Truncation \
  CONFIG.Output_Data_Width 32 \
  CONFIG.Use_Xtreme_DSP_Slice false \
  CONFIG.HAS_ARESETN true \
  CONFIG.HAS_DOUT_TREADY true \
] [get_bd_cells cic_compiler_I]
create_bd_cell -type ip -vlnv xilinx.com:ip:cic_compiler:4.0 cic_compiler_Q
set_property -dict [list \
  CONFIG.Filter_Type Decimation \
  CONFIG.Number_Of_Stages 5 \
  CONFIG.Fixed_Or_Initial_Rate 32 \
  CONFIG.Minimum_Rate 32 \
  CONFIG.Maximum_Rate 32 \
  CONFIG.Input_Sample_Frequency 125 \
  CONFIG.Clock_Frequency 125 \
  CONFIG.SamplePeriod 1 \
  CONFIG.Input_Data_Width 32 \
  CONFIG.Quantization Truncation \
  CONFIG.Output_Data_Width 32 \
  CONFIG.Use_Xtreme_DSP_Slice false \
  CONFIG.HAS_ARESETN true \
  CONFIG.HAS_DOUT_TREADY true \
] [get_bd_cells cic_compiler_Q]
create_bd_cell -type ip -vlnv xilinx.com:ip:cmpy:6.0 cmpy_0
set_property -dict [list \
  CONFIG.APortWidth 16 \
  CONFIG.BPortWidth 24 \
  CONFIG.FlowControl Blocking \
  CONFIG.RoundMode Truncate \
  CONFIG.OutputWidth 32 \
  CONFIG.MinimumLatency 9 \
  CONFIG.ARESETN true \
] [get_bd_cells cmpy_0]
create_bd_cell -type ip -vlnv xilinx.com:ip:dds_compiler:6.0 dds_compiler_0
set_property -dict [list \
  CONFIG.PartsPresent Phase_Generator_and_SIN_COS_LUT \
  CONFIG.DDS_Clock_Rate 125 \
  CONFIG.Parameter_Entry System_Parameters \
  CONFIG.Spurious_Free_Dynamic_Range 138 \
  CONFIG.Frequency_Resolution 0.2 \
  CONFIG.Noise_Shaping Auto \
  CONFIG.Phase_Width 30 \
  CONFIG.Output_Width 24 \
  CONFIG.Phase_Increment Programmable \
  CONFIG.Negative_Sine true \
  CONFIG.Optimization_Goal Auto \
  CONFIG.DSP48_Use Minimal \
  CONFIG.Has_Phase_Out false \
  CONFIG.DATA_Has_TLAST Not_Required \
  CONFIG.Has_TREADY true \
  CONFIG.S_PHASE_Has_TUSER Not_Required \
  CONFIG.M_DATA_Has_TUSER Not_Required \
  CONFIG.Latency 16 \
  CONFIG.Has_ARESETn true \
  CONFIG.Output_Frequency1 0 \
  CONFIG.PINC1 0 \
] [get_bd_cells dds_compiler_0]

# ---- hierarchy /RX/rx_7 ----
current_bd_instance /RX/rx_7
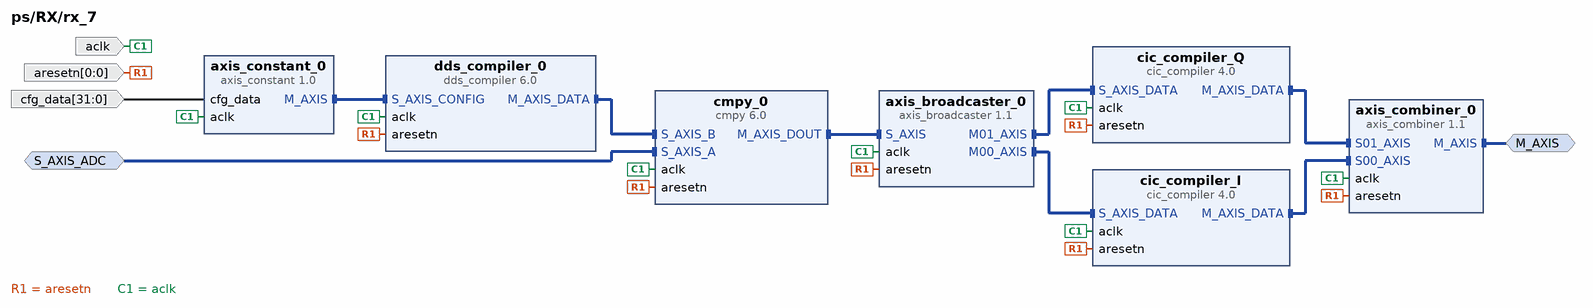
[diagram p13: block diagram inside /RX/rx_7]
create_bd_intf_pin -mode Slave -vlnv xilinx.com:interface:axis_rtl:1.0 S_AXIS_ADC
create_bd_intf_pin -mode Master -vlnv xilinx.com:interface:axis_rtl:1.0 M_AXIS
create_bd_pin -dir I aclk
create_bd_pin -dir I -from 0 -to 0 aresetn
create_bd_pin -dir I -from 31 -to 0 cfg_data

create_bd_cell -type ip -vlnv pavel-demin:user:axis_constant:1.0 axis_constant_0
create_bd_cell -type ip -vlnv xilinx.com:ip:axis_broadcaster:1.1 axis_broadcaster_0
set_property -dict [list \
  CONFIG.M_TDATA_NUM_BYTES 4 \
  CONFIG.S_TDATA_NUM_BYTES 8 \
  CONFIG.M00_TDATA_REMAP {tdata[31:0]} \
  CONFIG.M01_TDATA_REMAP {tdata[63:32]} \
] [get_bd_cells axis_broadcaster_0]
create_bd_cell -type ip -vlnv xilinx.com:ip:axis_combiner:1.1 axis_combiner_0
set_property -dict {CONFIG.TDATA_NUM_BYTES 4 CONFIG.HAS_TLAST 1} [get_bd_cells axis_combiner_0]
create_bd_cell -type ip -vlnv xilinx.com:ip:cic_compiler:4.0 cic_compiler_I
set_property -dict [list \
  CONFIG.Filter_Type Decimation \
  CONFIG.Number_Of_Stages 5 \
  CONFIG.Fixed_Or_Initial_Rate 32 \
  CONFIG.Minimum_Rate 32 \
  CONFIG.Maximum_Rate 32 \
  CONFIG.Input_Sample_Frequency 125 \
  CONFIG.Clock_Frequency 125 \
  CONFIG.SamplePeriod 1 \
  CONFIG.Input_Data_Width 32 \
  CONFIG.Quantization Truncation \
  CONFIG.Output_Data_Width 32 \
  CONFIG.Use_Xtreme_DSP_Slice false \
  CONFIG.HAS_ARESETN true \
  CONFIG.HAS_DOUT_TREADY true \
] [get_bd_cells cic_compiler_I]
create_bd_cell -type ip -vlnv xilinx.com:ip:cic_compiler:4.0 cic_compiler_Q
set_property -dict [list \
  CONFIG.Filter_Type Decimation \
  CONFIG.Number_Of_Stages 5 \
  CONFIG.Fixed_Or_Initial_Rate 32 \
  CONFIG.Minimum_Rate 32 \
  CONFIG.Maximum_Rate 32 \
  CONFIG.Input_Sample_Frequency 125 \
  CONFIG.Clock_Frequency 125 \
  CONFIG.SamplePeriod 1 \
  CONFIG.Input_Data_Width 32 \
  CONFIG.Quantization Truncation \
  CONFIG.Output_Data_Width 32 \
  CONFIG.Use_Xtreme_DSP_Slice false \
  CONFIG.HAS_ARESETN true \
  CONFIG.HAS_DOUT_TREADY true \
] [get_bd_cells cic_compiler_Q]
create_bd_cell -type ip -vlnv xilinx.com:ip:cmpy:6.0 cmpy_0
set_property -dict [list \
  CONFIG.APortWidth 16 \
  CONFIG.BPortWidth 24 \
  CONFIG.FlowControl Blocking \
  CONFIG.RoundMode Truncate \
  CONFIG.OutputWidth 32 \
  CONFIG.MinimumLatency 9 \
  CONFIG.ARESETN true \
] [get_bd_cells cmpy_0]
create_bd_cell -type ip -vlnv xilinx.com:ip:dds_compiler:6.0 dds_compiler_0
set_property -dict [list \
  CONFIG.PartsPresent Phase_Generator_and_SIN_COS_LUT \
  CONFIG.DDS_Clock_Rate 125 \
  CONFIG.Parameter_Entry System_Parameters \
  CONFIG.Spurious_Free_Dynamic_Range 138 \
  CONFIG.Frequency_Resolution 0.2 \
  CONFIG.Noise_Shaping Auto \
  CONFIG.Phase_Width 30 \
  CONFIG.Output_Width 24 \
  CONFIG.Phase_Increment Programmable \
  CONFIG.Negative_Sine true \
  CONFIG.Optimization_Goal Auto \
  CONFIG.DSP48_Use Minimal \
  CONFIG.Has_Phase_Out false \
  CONFIG.DATA_Has_TLAST Not_Required \
  CONFIG.Has_TREADY true \
  CONFIG.S_PHASE_Has_TUSER Not_Required \
  CONFIG.M_DATA_Has_TUSER Not_Required \
  CONFIG.Latency 16 \
  CONFIG.Has_ARESETn true \
  CONFIG.Output_Frequency1 0 \
  CONFIG.PINC1 0 \
] [get_bd_cells dds_compiler_0]

# ---- connections ----

current_bd_instance /TX
connect_bd_intf_net [get_bd_intf_pins cic_compiler_0/M_AXIS_DATA] [get_bd_intf_pins axis_combiner_0/S00_AXIS]
connect_bd_intf_net [get_bd_intf_pins cic_compiler_1/M_AXIS_DATA] [get_bd_intf_pins axis_combiner_0/S01_AXIS]
connect_bd_intf_net [get_bd_intf_pins axis_combiner_0/M_AXIS] [get_bd_intf_pins cmpy_0/S_AXIS_A]
connect_bd_intf_net [get_bd_intf_pins axis_broadcaster_0/M00_AXIS] [get_bd_intf_pins cic_compiler_0/S_AXIS_DATA]
connect_bd_intf_net [get_bd_intf_pins axis_broadcaster_0/M01_AXIS] [get_bd_intf_pins cic_compiler_1/S_AXIS_DATA]
connect_bd_intf_net [get_bd_intf_pins dds_compiler_0/M_AXIS_DATA] [get_bd_intf_pins cmpy_0/S_AXIS_B]
connect_bd_intf_net [get_bd_intf_pins axis_variable_0/M_AXIS] [get_bd_intf_pins cic_compiler_0/S_AXIS_CONFIG]
connect_bd_intf_net [get_bd_intf_pins axis_variable_1/M_AXIS] [get_bd_intf_pins cic_compiler_1/S_AXIS_CONFIG]
connect_bd_intf_net [get_bd_intf_pins axis_constant_0/M_AXIS] [get_bd_intf_pins dds_compiler_0/S_AXIS_PHASE]
connect_bd_intf_net [get_bd_intf_pins axis_broadcaster_0/S_AXIS] [get_bd_intf_pins fir_compiler_0/M_AXIS_DATA]
connect_bd_intf_net [get_bd_intf_pins cmpy_0/M_AXIS_DOUT] [get_bd_intf_pins axis_broadcaster_1/S_AXIS]
connect_bd_intf_net [get_bd_intf_pins S_AXI_CFG] [get_bd_intf_pins axi_cfg_register_0/S_AXI]
connect_bd_intf_net [get_bd_intf_pins S_AXIS_TX] [get_bd_intf_pins fir_compiler_0/S_AXIS_DATA]
connect_bd_intf_net [get_bd_intf_pins M00_AXIS_TX] [get_bd_intf_pins axis_broadcaster_1/M00_AXIS]
connect_bd_intf_net [get_bd_intf_pins M01_AXIS_TX] [get_bd_intf_pins axis_broadcaster_1/M01_AXIS]
connect_bd_net [get_bd_pins aclk] \
  [get_bd_pins axis_variable_1/aclk] [get_bd_pins axis_variable_0/aclk] [get_bd_pins axis_constant_0/aclk] \
  [get_bd_pins axi_cfg_register_0/aclk] [get_bd_pins axis_broadcaster_0/aclk] [get_bd_pins axis_broadcaster_1/aclk] \
  [get_bd_pins axis_combiner_0/aclk] [get_bd_pins cic_compiler_0/aclk] [get_bd_pins cic_compiler_1/aclk] \
  [get_bd_pins cmpy_0/aclk] [get_bd_pins dds_compiler_0/aclk] [get_bd_pins fir_compiler_0/aclk]
connect_bd_net [get_bd_pins xlslice_0/Dout] [get_bd_pins axis_variable_0/cfg_data] [get_bd_pins axis_variable_1/cfg_data]
connect_bd_net [get_bd_pins axi_cfg_register_0/cfg_data] [get_bd_pins xlslice_0/Din] [get_bd_pins xlslice_1/Din]
connect_bd_net [get_bd_pins xlslice_1/Dout] [get_bd_pins axis_constant_0/cfg_data]
connect_bd_net [get_bd_pins aresetn] \
  [get_bd_pins axis_variable_0/aresetn] [get_bd_pins axis_variable_1/aresetn] [get_bd_pins axi_cfg_register_0/aresetn] \
  [get_bd_pins axis_broadcaster_0/aresetn] [get_bd_pins axis_broadcaster_1/aresetn] [get_bd_pins axis_combiner_0/aresetn] \
  [get_bd_pins cic_compiler_0/aresetn] [get_bd_pins cic_compiler_1/aresetn] [get_bd_pins cmpy_0/aresetn] \
  [get_bd_pins dds_compiler_0/aresetn] [get_bd_pins fir_compiler_0/aresetn]

current_bd_instance /RX
connect_bd_intf_net [get_bd_intf_pins cic_compiler_0/M_AXIS_DATA] [get_bd_intf_pins fir_compiler_0/S_AXIS_DATA]
connect_bd_intf_net [get_bd_intf_pins axis_combiner_1/M_AXIS] [get_bd_intf_pins axis_dwidth_converter_0/S_AXIS]
connect_bd_intf_net [get_bd_intf_pins rx_1/M_AXIS] [get_bd_intf_pins axis_combiner_1/S01_AXIS]
connect_bd_intf_net [get_bd_intf_pins RX_Connect/M00_AXIS1] [get_bd_intf_pins rx_1/S_AXIS_ADC]
connect_bd_intf_net [get_bd_intf_pins cic_compiler_1/M_AXIS_DATA] [get_bd_intf_pins fir_compiler_1/S_AXIS_DATA]
connect_bd_intf_net [get_bd_intf_pins axis_broadcaster_3/S_AXIS] [get_bd_intf_pins axis_dwidth_converter_0/M_AXIS]
connect_bd_intf_net [get_bd_intf_pins axis_broadcaster_3/M00_AXIS] [get_bd_intf_pins cic_compiler_0/S_AXIS_DATA]
connect_bd_intf_net [get_bd_intf_pins axis_broadcaster_3/M01_AXIS] [get_bd_intf_pins cic_compiler_1/S_AXIS_DATA]
connect_bd_intf_net [get_bd_intf_pins axis_data_fifo_0/S_AXIS] [get_bd_intf_pins axis_packetizer_0/M_AXIS]
connect_bd_intf_net [get_bd_intf_pins axis_data_fifo_0/M_AXIS] [get_bd_intf_pins axis_switch/S00_AXIS]
connect_bd_intf_net [get_bd_intf_pins axis_packetizer_1/M_AXIS] [get_bd_intf_pins axis_data_fifo_1/S_AXIS]
connect_bd_intf_net [get_bd_intf_pins axis_data_fifo_1/M_AXIS] [get_bd_intf_pins axis_switch/S01_AXIS]
connect_bd_intf_net [get_bd_intf_pins fir_compiler_0/M_AXIS_DATA] [get_bd_intf_pins axis_packetizer_0/S_AXIS]
connect_bd_intf_net [get_bd_intf_pins fir_compiler_1/M_AXIS_DATA] [get_bd_intf_pins axis_packetizer_1/S_AXIS]
connect_bd_intf_net [get_bd_intf_pins RX_Connect/M00_AXIS] [get_bd_intf_pins rx_0/S_AXIS_ADC]
connect_bd_intf_net [get_bd_intf_pins rx_0/M_AXIS] [get_bd_intf_pins axis_combiner_1/S00_AXIS]
connect_bd_intf_net [get_bd_intf_pins RX_Connect/M00_AXIS2] [get_bd_intf_pins rx_2/S_AXIS_ADC]
connect_bd_intf_net [get_bd_intf_pins rx_2/M_AXIS] [get_bd_intf_pins axis_combiner_1/S02_AXIS]
connect_bd_intf_net [get_bd_intf_pins RX_Connect/M00_AXIS3] [get_bd_intf_pins rx_3/S_AXIS_ADC]
connect_bd_intf_net [get_bd_intf_pins rx_3/M_AXIS] [get_bd_intf_pins axis_combiner_1/S03_AXIS]
connect_bd_intf_net [get_bd_intf_pins rx_4/M_AXIS] [get_bd_intf_pins axis_combiner_1/S04_AXIS]
connect_bd_intf_net [get_bd_intf_pins rx_5/M_AXIS] [get_bd_intf_pins axis_combiner_1/S05_AXIS]
connect_bd_intf_net [get_bd_intf_pins rx_6/M_AXIS] [get_bd_intf_pins axis_combiner_1/S06_AXIS]
connect_bd_intf_net [get_bd_intf_pins rx_7/M_AXIS] [get_bd_intf_pins axis_combiner_1/S07_AXIS]
connect_bd_intf_net [get_bd_intf_pins rx_4/S_AXIS_ADC] [get_bd_intf_pins RX_Connect/M00_AXIS4]
connect_bd_intf_net [get_bd_intf_pins rx_5/S_AXIS_ADC] [get_bd_intf_pins RX_Connect/M00_AXIS5]
connect_bd_intf_net [get_bd_intf_pins rx_6/S_AXIS_ADC] [get_bd_intf_pins RX_Connect/M00_AXIS6]
connect_bd_intf_net [get_bd_intf_pins rx_7/S_AXIS_ADC] [get_bd_intf_pins RX_Connect/M00_AXIS7]
connect_bd_intf_net [get_bd_intf_pins M00_AXIS] [get_bd_intf_pins axis_switch/M00_AXIS]
connect_bd_intf_net [get_bd_intf_pins ADC_I] [get_bd_intf_pins RX_Connect/S_AXIS0]
connect_bd_intf_net [get_bd_intf_pins ADC_Q] [get_bd_intf_pins RX_Connect/S_AXIS1]
connect_bd_intf_net [get_bd_intf_pins ADC_IQ] [get_bd_intf_pins RX_Connect/S_AXIS2]
connect_bd_intf_net [get_bd_intf_pins S00_AXI] [get_bd_intf_pins RX_Connect/S00_AXI]
connect_bd_intf_net [get_bd_intf_pins S_AXI] [get_bd_intf_pins axi_cfg_register_rx_freq/S_AXI]
connect_bd_net -net processing_system7_0_FCLK_CLK0 [get_bd_pins aclk] \
  [get_bd_pins axis_packetizer_0/aclk] [get_bd_pins axis_packetizer_1/aclk] [get_bd_pins axi_cfg_register_rx_freq/aclk] \
  [get_bd_pins axis_broadcaster_3/aclk] [get_bd_pins axis_combiner_1/aclk] [get_bd_pins axis_data_fifo_0/s_axis_aclk] \
  [get_bd_pins axis_data_fifo_1/s_axis_aclk] [get_bd_pins axis_dwidth_converter_0/aclk] [get_bd_pins axis_switch/aclk] \
  [get_bd_pins cic_compiler_0/aclk] [get_bd_pins cic_compiler_1/aclk] [get_bd_pins fir_compiler_0/aclk] \
  [get_bd_pins fir_compiler_1/aclk] [get_bd_pins rx_1/aclk] [get_bd_pins RX_Connect/aclk] [get_bd_pins rx_0/aclk] \
  [get_bd_pins rx_2/aclk] [get_bd_pins rx_3/aclk] [get_bd_pins rx_4/aclk] [get_bd_pins rx_5/aclk] [get_bd_pins rx_6/aclk] \
  [get_bd_pins rx_7/aclk]
connect_bd_net -net proc_sys_reset_0_peripheral_aresetn [get_bd_pins aresetn] \
  [get_bd_pins axis_packetizer_0/aresetn] [get_bd_pins axis_packetizer_1/aresetn] \
  [get_bd_pins axi_cfg_register_rx_freq/aresetn] [get_bd_pins axis_broadcaster_3/aresetn] \
  [get_bd_pins axis_combiner_1/aresetn] [get_bd_pins axis_data_fifo_0/s_axis_aresetn] \
  [get_bd_pins axis_data_fifo_1/s_axis_aresetn] [get_bd_pins axis_dwidth_converter_0/aresetn] \
  [get_bd_pins axis_switch/aresetn] [get_bd_pins cic_compiler_0/aresetn] [get_bd_pins cic_compiler_1/aresetn] \
  [get_bd_pins fir_compiler_0/aresetn] [get_bd_pins fir_compiler_1/aresetn] [get_bd_pins rx_1/aresetn] \
  [get_bd_pins RX_Connect/aresetn] [get_bd_pins rx_2/aresetn] [get_bd_pins rx_0/aresetn] [get_bd_pins rx_3/aresetn] \
  [get_bd_pins rx_4/aresetn] [get_bd_pins rx_5/aresetn] [get_bd_pins rx_6/aresetn] [get_bd_pins rx_7/aresetn]
connect_bd_net [get_bd_pins xlconstant_0/dout] [get_bd_pins axis_switch/s_req_suppress]
connect_bd_net [get_bd_pins xlconstant_3/dout] [get_bd_pins axis_packetizer_0/cfg_data]
connect_bd_net [get_bd_pins xlconstant_4/dout] [get_bd_pins axis_packetizer_1/cfg_data]
connect_bd_net [get_bd_pins xlslice_0/Dout] [get_bd_pins xlconcat_0/In0]
connect_bd_net [get_bd_pins xlslice_1/Dout] [get_bd_pins xlconcat_0/In2]
connect_bd_net [get_bd_pins xlconstant_1/dout] [get_bd_pins xlconcat_0/In1]
connect_bd_net [get_bd_pins xlconstant_2/dout] [get_bd_pins xlconcat_0/In3]
connect_bd_net [get_bd_pins xlconcat_0/dout] [get_bd_pins axis_switch/s_axis_tdata]
connect_bd_net [get_bd_pins axis_data_fifo_0/m_axis_tdata] [get_bd_pins xlslice_0/Din]
connect_bd_net [get_bd_pins axis_data_fifo_1/m_axis_tdata] [get_bd_pins xlslice_1/Din]
connect_bd_net -net axi_cfg_register_0_cfg_data [get_bd_pins axi_cfg_register_rx_freq/cfg_data] \
  [get_bd_pins xlslice_rx_0/Din] [get_bd_pins xlslice_rx_1/Din] [get_bd_pins xlslice_rx_2/Din] [get_bd_pins xlslice_rx_3/Din] \
  [get_bd_pins xlslice_rx_4/Din] [get_bd_pins xlslice_rx_5/Din] [get_bd_pins xlslice_rx_6/Din] [get_bd_pins xlslice_rx_7/Din]
connect_bd_net [get_bd_pins xlslice_rx_1/Dout] [get_bd_pins rx_1/cfg_data]
connect_bd_net [get_bd_pins xlslice_rx_0/Dout] [get_bd_pins rx_0/cfg_data]
connect_bd_net [get_bd_pins xlslice_rx_3/Dout] [get_bd_pins rx_3/cfg_data]
connect_bd_net [get_bd_pins xlslice_rx_2/Dout] [get_bd_pins rx_2/cfg_data]
connect_bd_net [get_bd_pins xlslice_rx_6/Dout] [get_bd_pins rx_6/cfg_data]
connect_bd_net [get_bd_pins xlslice_rx_5/Dout] [get_bd_pins rx_5/cfg_data]
connect_bd_net [get_bd_pins xlslice_rx_4/Dout] [get_bd_pins rx_4/cfg_data]
connect_bd_net [get_bd_pins xlslice_rx_7/Dout] [get_bd_pins rx_7/cfg_data]

current_bd_instance /RX/rx_1
connect_bd_intf_net [get_bd_intf_pins dds_compiler_0/M_AXIS_DATA] [get_bd_intf_pins cmpy_0/S_AXIS_B]
connect_bd_intf_net [get_bd_intf_pins cmpy_0/M_AXIS_DOUT] [get_bd_intf_pins axis_broadcaster_0/S_AXIS]
connect_bd_intf_net [get_bd_intf_pins cic_compiler_I/S_AXIS_DATA] [get_bd_intf_pins axis_broadcaster_0/M00_AXIS]
connect_bd_intf_net [get_bd_intf_pins axis_broadcaster_0/M01_AXIS] [get_bd_intf_pins cic_compiler_Q/S_AXIS_DATA]
connect_bd_intf_net [get_bd_intf_pins axis_constant_0/M_AXIS] [get_bd_intf_pins dds_compiler_0/S_AXIS_CONFIG]
connect_bd_intf_net [get_bd_intf_pins cic_compiler_I/M_AXIS_DATA] [get_bd_intf_pins axis_combiner_0/S00_AXIS]
connect_bd_intf_net [get_bd_intf_pins cic_compiler_Q/M_AXIS_DATA] [get_bd_intf_pins axis_combiner_0/S01_AXIS]
connect_bd_intf_net [get_bd_intf_pins S_AXIS_ADC] [get_bd_intf_pins cmpy_0/S_AXIS_A]
connect_bd_intf_net [get_bd_intf_pins M_AXIS] [get_bd_intf_pins axis_combiner_0/M_AXIS]
connect_bd_net [get_bd_pins aresetn] \
  [get_bd_pins axis_broadcaster_0/aresetn] [get_bd_pins axis_combiner_0/aresetn] [get_bd_pins cic_compiler_I/aresetn] \
  [get_bd_pins cic_compiler_Q/aresetn] [get_bd_pins cmpy_0/aresetn] [get_bd_pins dds_compiler_0/aresetn]
connect_bd_net [get_bd_pins aclk] \
  [get_bd_pins axis_constant_0/aclk] [get_bd_pins axis_broadcaster_0/aclk] [get_bd_pins axis_combiner_0/aclk] \
  [get_bd_pins cic_compiler_I/aclk] [get_bd_pins cic_compiler_Q/aclk] [get_bd_pins cmpy_0/aclk] \
  [get_bd_pins dds_compiler_0/aclk]
connect_bd_net [get_bd_pins cfg_data] [get_bd_pins axis_constant_0/cfg_data]
